# Altium project ReproAmp_V87_Stage_0.01.PrjPcb
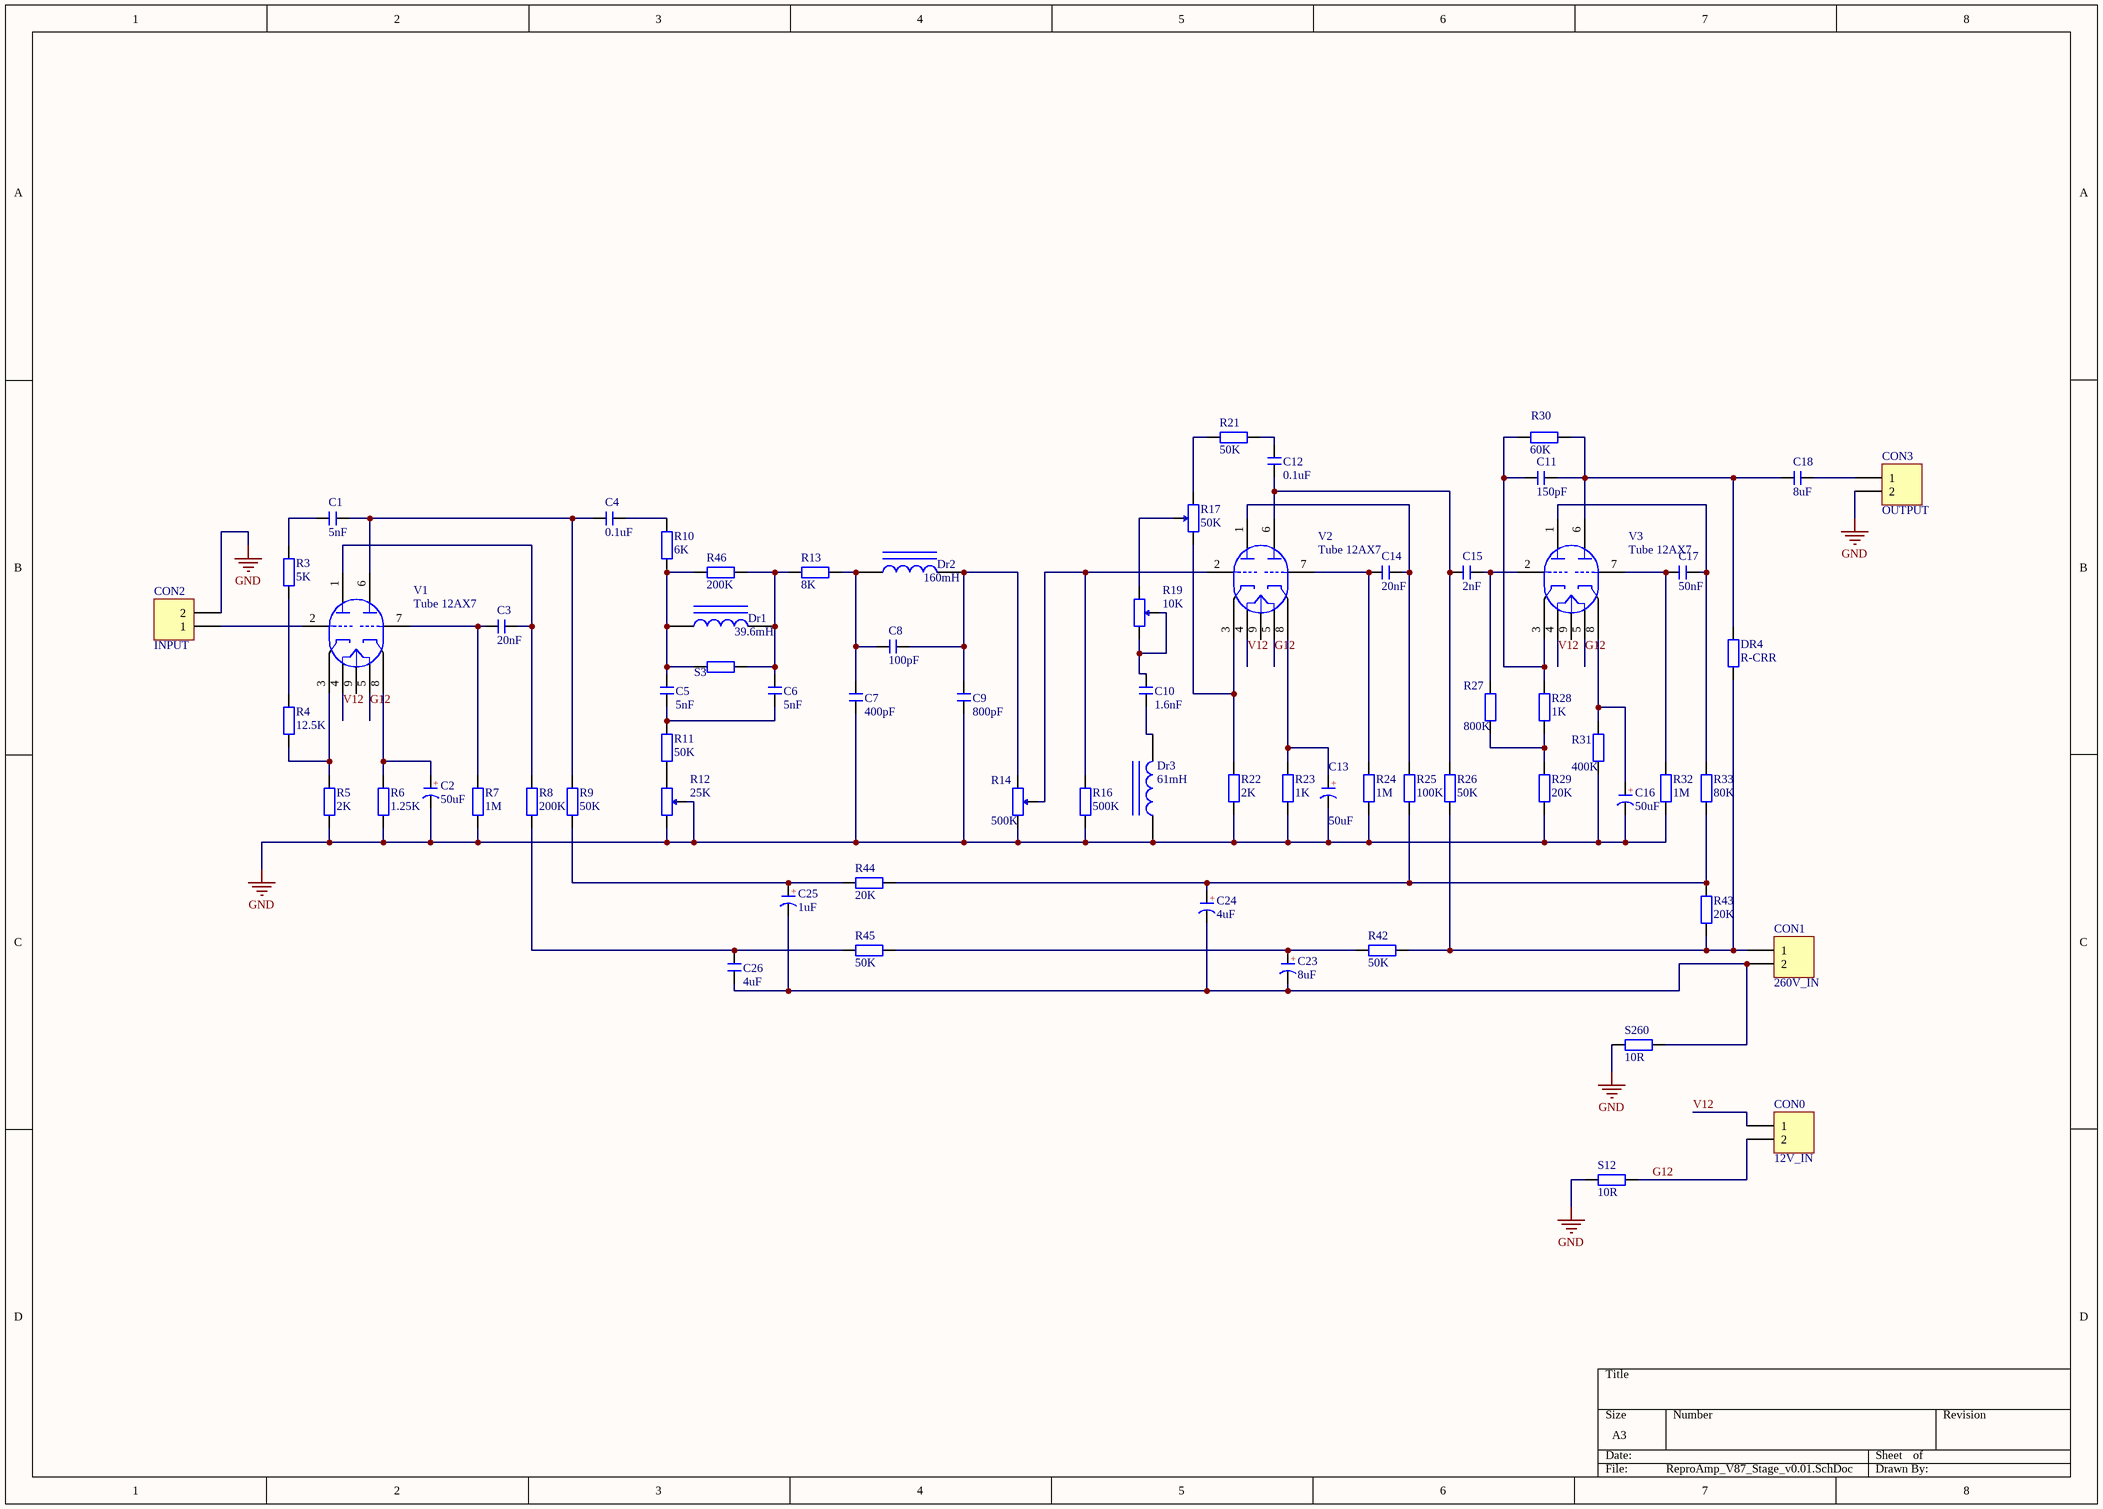
[diagram p0: ReproAmp_V87_Stage_v0.01.SchDoc]
1 sheet, 69 parts. Net scope: global (net labels, ports and power ports of the same name join across sheets).
Board file: Repro_Amp_V87_Stage_v0.01.PcbDoc

## Sheet ReproAmp_V87_Stage_v0.01.SchDoc
size A3

### Parts
C1  5nF  [CY 7.5*10*4]
C2  50uF  [CAP 5.0*12.5*20]
C3  20nF  [CBB 10*12*8]
C4  0.1uF  [CBB 15*18*11]
C5  5nF  [CBB 7.2*7.2*13]
C6  5nF  [CBB 7.2*7.2*13]
C7  400pF  [CBB 7.2*7.2*13]
C8  100pF  [CBB 7.2*7.2*13]
C9  800pF  [CBB 7.2*7.2*13]
C10  1.6nF  [CBB 7.2*7.2*13]
C11  150pF  [CBB 15*18*11]
C12  0.1uF  [CBB 15*18*11]
C13  50uF  [CAP 5.0*12.5*20]
C14  20nF  [CBB 10*12*8]
C15  2nF  [CY 7.5*8*4]
C16  50uF  [CAP 5.0*12.5*20]
C17  50nF  [CBB 15*18*11]
C18  8uF  [CBB 50*30*30]
C23  8uF  [CAP 5.0*12.5*20]
C24  4uF  [CAP 5.0*12.5*20]
C25  1uF  [CAP 5.0*12.5*20]
C26  4uF  [CBB 20*23*17]
CON0  12V_IN  [HX5.08-2L]
CON1  260V_IN  [HX5.08-2L]
CON2  INPUT  [HX5.08-2L]
CON3  OUTPUT  [HX5.08-2L]
Dr1  39.6mH  [AXIAL-0.5]
Dr2  160mH  [AXIAL-0.5]
Dr3  61mH  [AXIAL-0.5]
DR4  R-CRR  [RS 2W]
R3  5K  [RS 1W]
R4  12.5K  [RS 1W]
R5  2K  [RS 1W]
R6  1.25K  [RS 1W]
R7  1M  [RS 1W]
R8  200K  [RS 1W]
R9  50K  [RS 2W]
R10  6K  [RS 1/2W]
R11  50K  [RS 1/2W]
R12  25K  [RS 1/2W-VR]
R13  8K  [RS 1/2W]
R14  500K  [RS 1/2W-VR]
R16  500K  [RS 1W]
R17  50K  [RS 1/2W-VR]
R19  10K  [RS 1/2W-VR]
R21  50K  [RS 1W]
R22  2K  [RS 1W]
R23  1K  [RS 1W]
R24  1M  [RS 1W]
R25  100K  [RS 2W]
R26  50K  [RS 1W]
R27  800K  [RS 1W]
R28  1K  [RS 1W]
R29  20K  [RS 1W]
R30  60K  [RS 1W]
R31  400K  [RS 1W]
R32  1M  [RS 1W]
R33  80K  [RS 2W]
R42  50K  [RS 1W]
R43  20K  [RS 1W]
R44  20K  [RS 1W]
R45  50K  [RS 1W]
R46  200K  [RS 1/2W]
S3  0  [RS 1/2W]  (value not drawn)
S12  10R  [RS 1W]
S260  10R  [RS 1W]
V1  Tube 12AX7  [VTUBE-9-W]
V2  Tube 12AX7  [VTUBE-9-W]
V3  Tube 12AX7  [VTUBE-9-W]

### Nets
GND: C2.2(K) C7.1 C9.1 C13.2(K) C16.2(K) CON2.2 CON3.2 Dr3.1 R5.1 R6.1 R7.1 R12.2 R12.3 R14.2 R16.1 R22.1 R23.1 R24.1 R29.1 R31.2 R32.2 S12.1 S260.1
G12: CON0.2 S12.2 V1.5(H) V2.5(H) V3.5(H)
V12: CON0.1 V1.4(H) V2.4(H) V3.4(H)
NetC1_1: C1.1 R3.2
NetC1_2: C1.2 C4.1 R9.2 V1.6(PT2)
NetC2_1: C2.1(A) R6.2 V1.8(KT2)
NetC3_1: C3.1 R7.2 V1.7(GT2)
NetC3_2: C3.2 R8.2 V1.1(PT1)
NetC4_2: C4.2 R10.2
NetC5_1: C5.1 C6.1 R11.2
NetC5_2: C5.2 Dr1.1 R10.1 R46.1 S3.1
NetC6_2: C6.2 Dr1.2 R13.1 R46.2 S3.2
NetC7_2: C7.2 C8.2 Dr2.1 R13.2
NetC8_1: C8.1 C9.2 Dr2.2 R14.1
NetC10_1: C10.1 Dr3.2
NetC10_2: C10.2 R19.2 R19.3
NetC11_1: C11.1 R28.2 R30.2 V3.3(KT1)
NetC11_2: C11.2 C18.1 DR4.2 R30.1 V3.6(PT2)
NetC12_1: C12.1 C15.1 R26.2 V2.6(PT2)
NetC12_2: C12.2 R21.2
NetC13_1: C13.1(A) R23.2 V2.8(KT2)
NetC14_1: C14.1 R24.2 V2.7(GT2)
NetC14_2: C14.2 R25.2 V2.1(PT1)
NetC15_2: C15.2 R27.2 V3.2(GT1)
NetC16_1: C16.1(A) R31.1 V3.8(KT2)
NetC17_1: C17.1 R32.1 V3.7(GT2)
NetC17_2: C17.2 R33.1 V3.1(PT1)
NetC18_2: C18.2 CON3.1
NetC23_1: C23.1(A) R42.1 R45.2
NetC23_2: C23.2(K) C24.2(K) C25.2(K) C26.2 CON1.2 S260.2
NetC24_1: C24.1(A) R25.1 R33.2 R43.2 R44.2
NetC25_1: C25.1(A) R9.1 R44.1
NetC26_1: C26.1 R8.1 R45.1
NetCON1_1: CON1.1 DR4.1 R26.1 R42.2 R43.1
NetCON2_1: CON2.1 V1.2(GT1)
NetR3_1: R3.1 R4.2
NetR4_1: R4.1 R5.2 V1.3(KT1)
NetR11_1: R11.1 R12.1
NetR14_3: R14.3 R16.2 V2.2(GT1)
NetR17_1: R17.1 R21.1
NetR17_2: R17.2 R22.2 V2.3(KT1)
NetR17_3: R17.3 R19.1
NetR27_1: R27.1 R28.1 R29.2

Not connected (* = marked no-connect by the designer): V1 9(HM); V2 9(HM); V3 9(HM)

### Notes on the sheet
- (in symbol C-CAP) +

### Library data of the parts
C1 C3-C12 C14 C15 C17 C18 C26 = C-CBB: CBB电容; 版权归属: 源创客; BOM名称: CBB电容; 学习资源: www.ooocke.com
C2 C13 C16 C23-C25 = C-CAP: 直插电解电容; 版权归属: 源创客; BOM名称: 直插电解电容; 学习资源: www.ooocke.com
CON0-CON3 = EDG5.08-2P
Dr1 = Inductor Iron: Magnetic-Core Inductor; Published: 24-Mar-1999; LatestRevisionDate: 17-Jul-2002; LatestRevisionNote: Re-released for DXP Platform.; PackageReference: AXIAL-0.9; Publisher: Altium Limited; PackageDescription: Axial Device, Thru-Hole; 2 Leads; 0.9 in Pin Spacing; Value: 39.6mH
Dr2 Dr3 = Inductor Iron: Magnetic-Core Inductor; Value: 10mH; Published: 24-Mar-1999; LatestRevisionDate: 17-Jul-2002; LatestRevisionNote: Re-released for DXP Platform.; PackageReference: AXIAL-0.9; Publisher: Altium Limited; PackageDescription: Axial Device, Thru-Hole; 2 Leads; 0.9 in Pin Spacing
DR4 R3-R11 R13 R16 R21-R33 R42-R46 S3 S12 S260 = R-CRR: 直插色环电阻; BOM名称: 色环电阻; 版权归属: 源创客; 学习资源: www.ooocke.com
R12 R14 R17 R19 = VR-W: 直插可调电阻-顶调
V1-V3 = Tube 12AX7: High Mu Dual Triode; Published: 8-Jun-2000; LatestRevisionDate: 17-Jul-2002; LatestRevisionNote: Re-released for DXP Platform.; PackageReference: VTUBE-9; Publisher: Altium Limited; PackageDescription: Vacuum Tube; 9 Leads